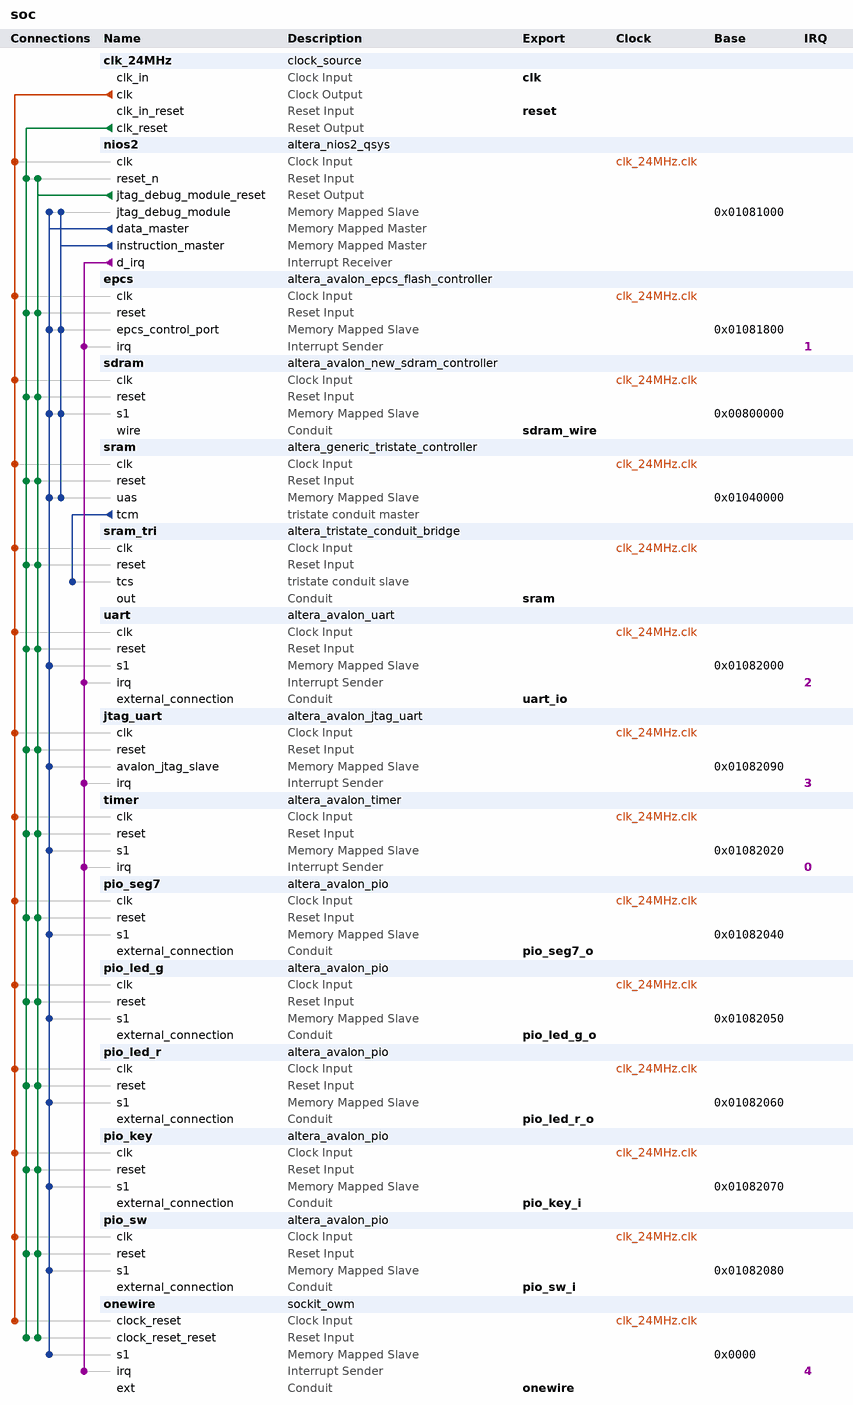
[diagram p0: system contents]
# Platform Designer (Qsys) system soc
# Parameters at their usual value, and those the tool derives, are not listed.
package require -exact qsys 11.0
create_system soc
set_project_property DEVICE_FAMILY CYCLONEII

add_instance clk_24MHz clock_source 11.0
set_instance_parameter_value clk_24MHz clockFrequency 24000000

add_instance nios2 altera_nios2_qsys 11.0
set_instance_parameter_value nios2 manuallyAssignCpuID false
set_instance_parameter_value nios2 resetSlave epcs.epcs_control_port
set_instance_parameter_value nios2 exceptionSlave sram.uas
set_instance_parameter_value nios2 breakSlave nios2.jtag_debug_module
set_instance_parameter_value nios2 impl Fast
set_instance_parameter_value nios2 icache_size 4096

add_instance epcs altera_avalon_epcs_flash_controller 11.0
set_instance_parameter_value epcs useASMIAtom true

add_instance sdram altera_avalon_new_sdram_controller 11.0
set_instance_parameter_value sdram TAC 5.4
set_instance_parameter_value sdram TRCD 20.0
set_instance_parameter_value sdram TRP 20.0
set_instance_parameter_value sdram casLatency 2
set_instance_parameter_value sdram columnWidth 8
set_instance_parameter_value sdram dataWidth 16
set_instance_parameter_value sdram generateSimulationModel false
set_instance_parameter_value sdram model custom
set_instance_parameter_value sdram numberOfBanks 4
set_instance_parameter_value sdram numberOfChipSelects 1
set_instance_parameter_value sdram powerUpDelay 100.0
set_instance_parameter_value sdram refreshPeriod 15.625
set_instance_parameter_value sdram rowWidth 12

add_instance sram altera_generic_tristate_controller 11.0
set_instance_parameter_value sram TCM_ADDRESS_W 18
set_instance_parameter_value sram TCM_DATA_W 16
set_instance_parameter_value sram TCM_BYTEENABLE_W 2
set_instance_parameter_value sram TCM_READ_WAIT 1
set_instance_parameter_value sram TCM_WRITE_WAIT 1
set_instance_parameter_value sram TCM_SETUP_WAIT 1
set_instance_parameter_value sram TCM_DATA_HOLD 1
set_instance_parameter_value sram TCM_MAX_PENDING_READ_TRANSACTIONS 1
set_instance_parameter_value sram TCM_TURNAROUND_TIME 2
set_instance_parameter_value sram TCM_TIMING_UNITS 1
set_instance_parameter_value sram TCM_READLATENCY 2
set_instance_parameter_value sram TCM_SYMBOLS_PER_WORD 2
set_instance_parameter_value sram USE_READ 1
set_instance_parameter_value sram USE_BEGINTRANSFER 0
set_instance_parameter_value sram USE_BYTEENABLE 1
set_instance_parameter_value sram USE_OUTPUTENABLE 1
set_instance_parameter_value sram ACTIVE_LOW_READ 0
set_instance_parameter_value sram ACTIVE_LOW_BYTEENABLE 1
set_instance_parameter_value sram ACTIVE_LOW_OUTPUTENABLE 1
set_instance_parameter_value sram ACTIVE_LOW_BEGINTRANSFER 0
set_instance_parameter_value sram CHIPSELECT_THROUGH_READLATENCY 0

add_instance sram_tri altera_tristate_conduit_bridge 11.0

add_instance uart altera_avalon_uart 11.0
set_instance_parameter_value uart baud 115200
set_instance_parameter_value uart dataBits 8
set_instance_parameter_value uart fixedBaud true
set_instance_parameter_value uart parity NONE
set_instance_parameter_value uart stopBits 1

add_instance jtag_uart altera_avalon_jtag_uart 11.0
set_instance_parameter_value jtag_uart simInteractiveOptions INTERACTIVE_ASCII_OUTPUT

add_instance timer altera_avalon_timer 11.0
set_instance_parameter_value timer period 1
set_instance_parameter_value timer periodUnits MSEC
set_instance_parameter_value timer timerPreset CUSTOM

add_instance pio_seg7 altera_avalon_pio 11.0
set_instance_parameter_value pio_seg7 direction Output
set_instance_parameter_value pio_seg7 width 32

add_instance pio_led_g altera_avalon_pio 11.0
set_instance_parameter_value pio_led_g direction Output
set_instance_parameter_value pio_led_g width 8

add_instance pio_led_r altera_avalon_pio 11.0
set_instance_parameter_value pio_led_r direction Output
set_instance_parameter_value pio_led_r width 10

add_instance pio_key altera_avalon_pio 11.0
set_instance_parameter_value pio_key direction Input
set_instance_parameter_value pio_key width 4

add_instance pio_sw altera_avalon_pio 11.0
set_instance_parameter_value pio_sw direction Input
set_instance_parameter_value pio_sw width 10

add_instance onewire sockit_owm 1.3
set_instance_parameter_value onewire OVD_E true
set_instance_parameter_value onewire CDR_E false
set_instance_parameter_value onewire BDW 32
set_instance_parameter_value onewire BAW 1
set_instance_parameter_value onewire OWN 1
set_instance_parameter_value onewire BTP_N 5.0
set_instance_parameter_value onewire BTP_O 1.0
set_instance_parameter_value onewire F_CLK 24000000

# connections
add_connection clk_24MHz.clk epcs.clk clock
add_connection clk_24MHz.clk jtag_uart.clk clock
add_connection clk_24MHz.clk nios2.clk clock
add_connection clk_24MHz.clk onewire.clock_reset clock
add_connection clk_24MHz.clk pio_key.clk clock
add_connection clk_24MHz.clk pio_led_g.clk clock
add_connection clk_24MHz.clk pio_led_r.clk clock
add_connection clk_24MHz.clk pio_seg7.clk clock
add_connection clk_24MHz.clk pio_sw.clk clock
add_connection clk_24MHz.clk sdram.clk clock
add_connection clk_24MHz.clk sram.clk clock
add_connection clk_24MHz.clk sram_tri.clk clock
add_connection clk_24MHz.clk timer.clk clock
add_connection clk_24MHz.clk uart.clk clock
add_connection clk_24MHz.clk_reset epcs.reset reset
add_connection clk_24MHz.clk_reset jtag_uart.reset reset
add_connection clk_24MHz.clk_reset nios2.reset_n reset
add_connection clk_24MHz.clk_reset onewire.clock_reset_reset reset
add_connection clk_24MHz.clk_reset pio_key.reset reset
add_connection clk_24MHz.clk_reset pio_led_g.reset reset
add_connection clk_24MHz.clk_reset pio_led_r.reset reset
add_connection clk_24MHz.clk_reset pio_seg7.reset reset
add_connection clk_24MHz.clk_reset pio_sw.reset reset
add_connection clk_24MHz.clk_reset sdram.reset reset
add_connection clk_24MHz.clk_reset sram.reset reset
add_connection clk_24MHz.clk_reset sram_tri.reset reset
add_connection clk_24MHz.clk_reset timer.reset reset
add_connection clk_24MHz.clk_reset uart.reset reset
add_connection nios2.jtag_debug_module_reset epcs.reset reset
add_connection nios2.jtag_debug_module_reset jtag_uart.reset reset
add_connection nios2.jtag_debug_module_reset nios2.reset_n reset
add_connection nios2.jtag_debug_module_reset onewire.clock_reset_reset reset
add_connection nios2.jtag_debug_module_reset pio_key.reset reset
add_connection nios2.jtag_debug_module_reset pio_led_g.reset reset
add_connection nios2.jtag_debug_module_reset pio_led_r.reset reset
add_connection nios2.jtag_debug_module_reset pio_seg7.reset reset
add_connection nios2.jtag_debug_module_reset pio_sw.reset reset
add_connection nios2.jtag_debug_module_reset sdram.reset reset
add_connection nios2.jtag_debug_module_reset sram.reset reset
add_connection nios2.jtag_debug_module_reset sram_tri.reset reset
add_connection nios2.jtag_debug_module_reset timer.reset reset
add_connection nios2.jtag_debug_module_reset uart.reset reset
add_connection nios2.data_master epcs.epcs_control_port avalon
set_connection_parameter_value nios2.data_master/epcs.epcs_control_port baseAddress 0x01081800
add_connection nios2.data_master jtag_uart.avalon_jtag_slave avalon
set_connection_parameter_value nios2.data_master/jtag_uart.avalon_jtag_slave baseAddress 0x01082090
add_connection nios2.data_master nios2.jtag_debug_module avalon
set_connection_parameter_value nios2.data_master/nios2.jtag_debug_module baseAddress 0x01081000
add_connection nios2.data_master onewire.s1 avalon
set_connection_parameter_value nios2.data_master/onewire.s1 baseAddress 0x0000
add_connection nios2.data_master pio_key.s1 avalon
set_connection_parameter_value nios2.data_master/pio_key.s1 baseAddress 0x01082070
add_connection nios2.data_master pio_led_g.s1 avalon
set_connection_parameter_value nios2.data_master/pio_led_g.s1 baseAddress 0x01082050
add_connection nios2.data_master pio_led_r.s1 avalon
set_connection_parameter_value nios2.data_master/pio_led_r.s1 baseAddress 0x01082060
add_connection nios2.data_master pio_seg7.s1 avalon
set_connection_parameter_value nios2.data_master/pio_seg7.s1 baseAddress 0x01082040
add_connection nios2.data_master pio_sw.s1 avalon
set_connection_parameter_value nios2.data_master/pio_sw.s1 baseAddress 0x01082080
add_connection nios2.data_master sdram.s1 avalon
set_connection_parameter_value nios2.data_master/sdram.s1 baseAddress 0x00800000
add_connection nios2.data_master sram.uas avalon
set_connection_parameter_value nios2.data_master/sram.uas baseAddress 0x01040000
add_connection nios2.data_master timer.s1 avalon
set_connection_parameter_value nios2.data_master/timer.s1 baseAddress 0x01082020
add_connection nios2.data_master uart.s1 avalon
set_connection_parameter_value nios2.data_master/uart.s1 baseAddress 0x01082000
add_connection nios2.instruction_master epcs.epcs_control_port avalon
set_connection_parameter_value nios2.instruction_master/epcs.epcs_control_port baseAddress 0x01081800
add_connection nios2.instruction_master nios2.jtag_debug_module avalon
set_connection_parameter_value nios2.instruction_master/nios2.jtag_debug_module baseAddress 0x01081000
add_connection nios2.instruction_master sdram.s1 avalon
set_connection_parameter_value nios2.instruction_master/sdram.s1 baseAddress 0x00800000
add_connection nios2.instruction_master sram.uas avalon
set_connection_parameter_value nios2.instruction_master/sram.uas baseAddress 0x01040000
add_connection nios2.d_irq epcs.irq interrupt
set_connection_parameter_value nios2.d_irq/epcs.irq irqNumber 1
add_connection nios2.d_irq jtag_uart.irq interrupt
set_connection_parameter_value nios2.d_irq/jtag_uart.irq irqNumber 3
add_connection nios2.d_irq onewire.irq interrupt
set_connection_parameter_value nios2.d_irq/onewire.irq irqNumber 4
add_connection nios2.d_irq timer.irq interrupt
set_connection_parameter_value nios2.d_irq/timer.irq irqNumber 0
add_connection nios2.d_irq uart.irq interrupt
set_connection_parameter_value nios2.d_irq/uart.irq irqNumber 2
add_connection sram.tcm sram_tri.tcs tristate_conduit

# exported interfaces
add_interface clk clock sink
set_interface_property clk EXPORT_OF clk_24MHz.clk_in
add_interface reset reset sink
set_interface_property reset EXPORT_OF clk_24MHz.clk_in_reset
add_interface sdram_wire conduit end
set_interface_property sdram_wire EXPORT_OF sdram.wire
add_interface uart_io conduit end
set_interface_property uart_io EXPORT_OF uart.external_connection
add_interface pio_seg7_o conduit end
set_interface_property pio_seg7_o EXPORT_OF pio_seg7.external_connection
add_interface pio_led_g_o conduit end
set_interface_property pio_led_g_o EXPORT_OF pio_led_g.external_connection
add_interface pio_led_r_o conduit end
set_interface_property pio_led_r_o EXPORT_OF pio_led_r.external_connection
add_interface pio_key_i conduit end
set_interface_property pio_key_i EXPORT_OF pio_key.external_connection
add_interface pio_sw_i conduit end
set_interface_property pio_sw_i EXPORT_OF pio_sw.external_connection
add_interface sram conduit end
set_interface_property sram EXPORT_OF sram_tri.out
add_interface onewire conduit end
set_interface_property onewire EXPORT_OF onewire.ext

save_system soc.qsys
